# Altium schematic sheet [06] - USB.SchDoc
size A3; CompanyName: FPT-FTI copporation; Address1: FPT Building Duy Tan; Address2: Floor 4,; DocumentNumber: 6; SheetNumber: 6; SheetTotal: 13; NameAuthor: Angle Vu
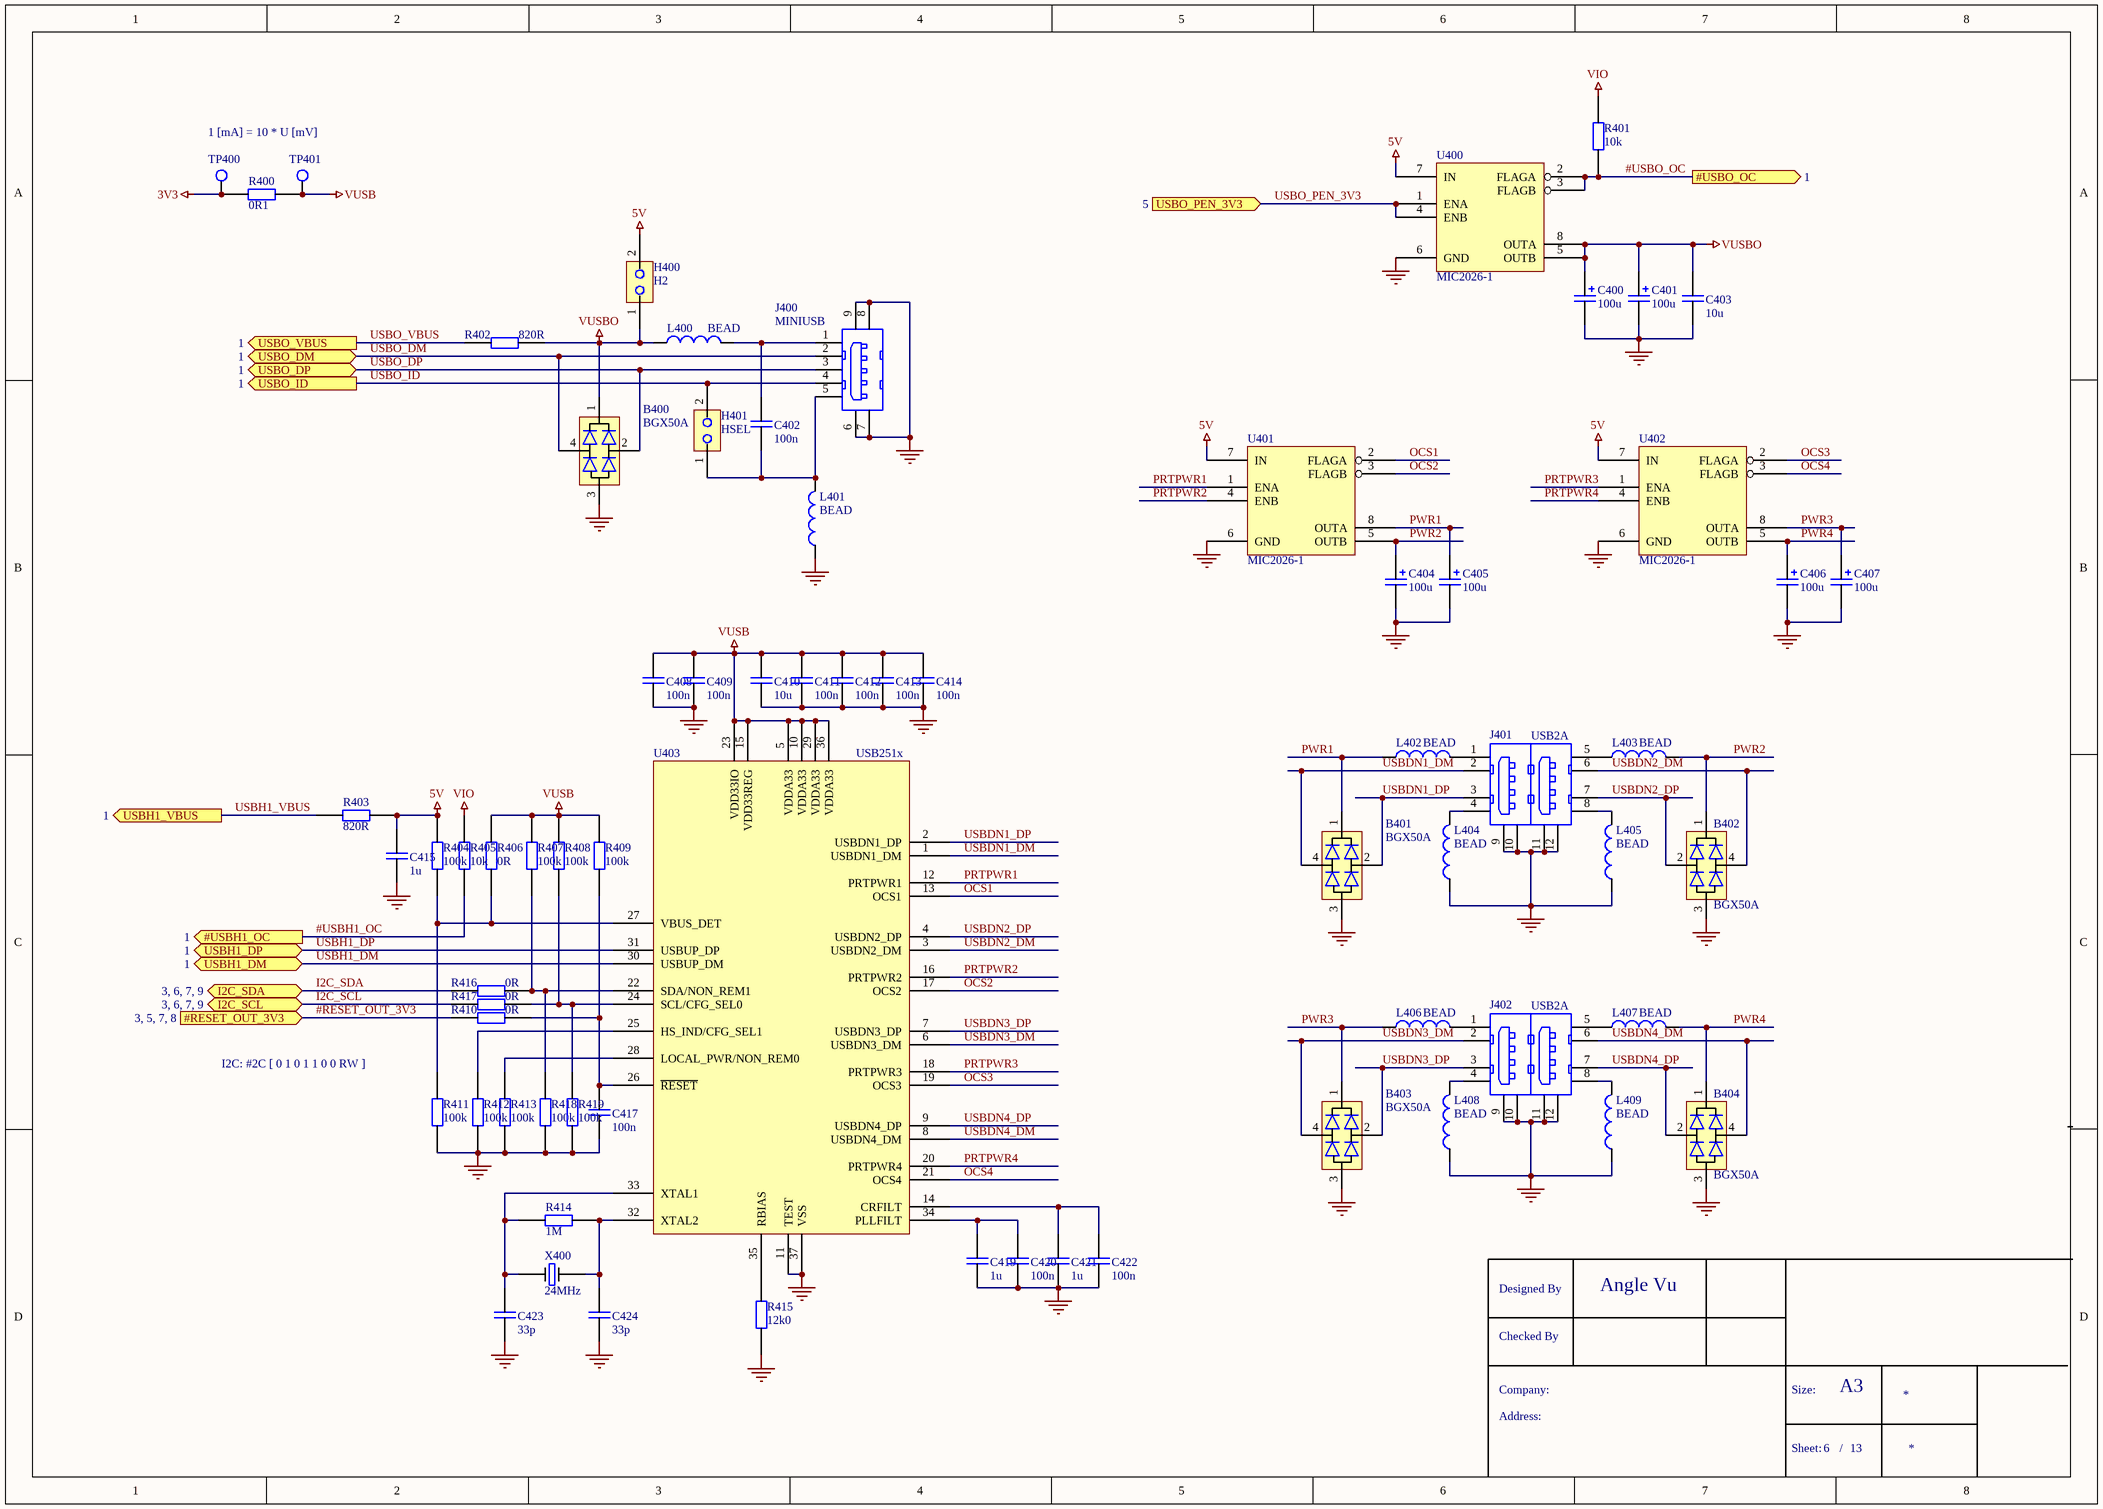
[diagram p0: [06] - USB.SchDoc]

## Parts
B400  BGX50A  [SOT143]
B401  BGX50A  [SOT143]
B402  BGX50A  [SOT143]
B403  BGX50A  [SOT143]
B404  BGX50A  [SOT143]
C400  100u  [CTANTALD]
C401  100u  [CTANTALD]
C402  100n  [0603]
C403  10u  [0805]
C404  100u  [CTANTALD]
C405  100u  [CTANTALD]
C406  100u  [CTANTALD]
C407  100u  [CTANTALD]
C408  100n  [0603]
C409  100n  [0603]
C410  10u  [0805]
C411  100n  [0603]
C412  100n  [0603]
C413  100n  [0603]
C414  100n  [0603]
C415  1u  [0603]
C417  100n  [0603]
C419  1u  [0603]
C420  100n  [0603]
C421  1u  [0603]
C422  100n  [0603]
C423  33p  [0603]
C424  33p  [0603]
H400  H2  [H1x2]
H401  HSEL  [H1x2]
J400  MINIUSB  [MINI_USB_AB]
J401  USB2A  [USB-2A]
J402  USB2A  [USB-2A]
L400  BEAD  [0603]
L401  BEAD  [0603]
L402  BEAD  [0603]
L403  BEAD  [0603]
L404  BEAD  [0603]
L405  BEAD  [0603]
L406  BEAD  [0603]
L407  BEAD  [0603]
L408  BEAD  [0603]
L409  BEAD  [0603]
R400  0R1  [0603]
R401  10k  [0603]
R402  820R  [0603]
R403  820R  [0603]
R404  100k  [0603]
R405  10k  [0603]
R406  0R  [0603]
R407  100k  [0603]
R408  100k  [0603]
R409  100k  [0603]
R410  0R  [0603]
R411  100k  [0603]
R412  100k  [0603]
R413  100k  [0603]
R414  1M  [0603]
R415  12k0  [0603]
R416  0R  [0603]
R417  0R  [0603]
R418  100k  [0603]
R419  100k  [0603]
TP400  TESTPOINT  [TESTPOINT_2mm]  (value not drawn)
TP401  TESTPOINT  [TESTPOINT_2mm]  (value not drawn)
U400  MIC2026-1  [SOIC8N]
U401  MIC2026-1  [SOIC8N]
U402  MIC2026-1  [SOIC8N]
U403  USB251x  [QFN36]
X400  24MHz  [HC494H]

## Ports
#RESET_OUT_3V3 (in, see 3, 5, 7, 8), #USBH1_OC (out, see 1), #USBO_OC (out, see 1), I2C_SCL (bidir, see 3, 6, 7, 9), I2C_SDA (bidir, see 3, 6, 7, 9), USBH1_DM (bidir, see 1), USBH1_DP (bidir, see 1), USBH1_VBUS (out, see 1), USBO_DM (bidir, see 1), USBO_DP (bidir, see 1), USBO_ID (out, see 1), USBO_PEN_3V3 (in, see 5), USBO_VBUS (out, see 1)

## Nets
3V3: R400.1 TP400.1
5V: C415.2 H400.2 R403.1 R404.2 U400.7(IN) U401.7(IN) U402.7(IN)
GND: B400.3 B401.3 B402.3 B403.3 B404.3 C400.2 C401.2 C403.1 C404.2 C405.2 C406.2 C407.2 C408.1 C409.1 C410.1 C411.1 C412.1 C413.1 C414.1 C415.1 C417.1 C419.1 C420.1 C421.1 C422.1 C423.1 C424.1 J400.6(SHIELD) J400.7(SHIELD) J400.8(SHIELD) J400.9(SHIELD) J401.9(SHIELD) J401.10(SHIELD) J401.11(SHIELD) J401.12(SHIELD) J402.9(SHIELD) J402.10(SHIELD) J402.11(SHIELD) J402.12(SHIELD) L401.1 L404.1 L405.1 L408.1 L409.1 R411.2 R412.2 R413.2 R415.1 R418.2 R419.2 U400.6(GND) U401.6(GND) U402.6(GND) U403.11(TEST) U403.37(VSS)
VIO: R401.1 R405.1
VUSB: C408.2 C409.2 C410.2 C411.2 C412.2 C413.2 C414.2 R400.2 R406.2 R407.1 R408.1 R409.1 TP401.1 U403.5(VDDA33) U403.10(VDDA33) U403.15(VDD33REG) U403.23(VDD33IO) U403.29(VDDA33) U403.36(VDDA33)
VUSBO: B400.1 C400.1 C401.1 C403.2 H400.1 L400.1 R402.1 U400.5(OUTB) U400.8(OUTA)
#RESET_OUT_3V3: R410.2 ; port #RESET_OUT_3V3
#USBH1_OC: R405.2 ; port #USBH1_OC
#USBO_OC: R401.2 U400.2(FLAGA) U400.3(FLAGB) ; port #USBO_OC
I2C_SCL: R417.2 ; port I2C_SCL
I2C_SDA: R416.2 ; port I2C_SDA
OCS1: U401.2(FLAGA) U403.13(OCS1)
OCS2: U401.3(FLAGB) U403.17(OCS2)
OCS3: U402.2(FLAGA) U403.19(OCS3)
OCS4: U402.3(FLAGB) U403.21(OCS4)
PRTPWR1: U401.1(ENA) U403.12(PRTPWR1)
PRTPWR2: U401.4(ENB) U403.16(PRTPWR2)
PRTPWR3: U402.1(ENA) U403.18(PRTPWR3)
PRTPWR4: U402.4(ENB) U403.20(PRTPWR4)
PWR1: B401.1 C405.1 L402.1 U401.8(OUTA)
PWR2: B402.1 C404.1 L403.2 U401.5(OUTB)
PWR3: B403.1 C407.1 L406.1 U402.8(OUTA)
PWR4: B404.1 C406.1 L407.2 U402.5(OUTB)
USBDN1_DM: B401.4 J401.2(D-) U403.1(USBDN1_DM)
USBDN1_DP: B401.2 J401.3(D+) U403.2(USBDN1_DP)
USBDN2_DM: B402.4 J401.6(D2-) U403.3(USBDN2_DM)
USBDN2_DP: B402.2 J401.7(D2+) U403.4(USBDN2_DP)
USBDN3_DM: B403.4 J402.2(D-) U403.6(USBDN3_DM)
USBDN3_DP: B403.2 J402.3(D+) U403.7(USBDN3_DP)
USBDN4_DM: B404.4 J402.6(D2-) U403.8(USBDN4_DM)
USBDN4_DP: B404.2 J402.7(D2+) U403.9(USBDN4_DP)
USBH1_DM: U403.30(USBUP_DM) ; port USBH1_DM
USBH1_DP: U403.31(USBUP_DP) ; port USBH1_DP
USBH1_VBUS: R403.2 ; port USBH1_VBUS
USBO_DM: B400.4 J400.2(D-) ; port USBO_DM
USBO_DP: B400.2 J400.3(D+) ; port USBO_DP
USBO_ID: H401.2 J400.4(ID) ; port USBO_ID
USBO_PEN_3V3: U400.1(ENA) U400.4(ENB) ; port USBO_PEN_3V3
USBO_VBUS: R402.2 ; port USBO_VBUS
NetC402_1: C402.1 H401.1 J400.5(GND) L401.2
NetC402_2: C402.2 J400.1(VBUS) L400.2
NetC417_2: C417.2 R409.2 R410.1 U403.26(~{RESET})
NetC419_2: C419.2 C420.2 U403.34(PLLFILT)
NetC421_2: C421.2 C422.2 U403.14(CRFILT)
NetC423_2: C423.2 R414.2 U403.33(XTAL1) X400.1
NetC424_2: C424.2 R414.1 U403.32(XTAL2) X400.2
NetJ401_1: J401.1(VBUS) L402.2
NetJ401_4: J401.4(GND) L404.2
NetJ401_5: J401.5(VBUS2) L403.1
NetJ401_8: J401.8(GND) L405.2
NetJ402_1: J402.1(VBUS) L406.2
NetJ402_4: J402.4(GND) L408.2
NetJ402_5: J402.5(VBUS2) L407.1
NetJ402_8: J402.8(GND) L409.2
NetR404_1: R404.1 R406.1 R411.1 U403.27(VBUS_DET)
NetR407_2: R407.2 R416.1 R418.1 U403.22(SDA/NON_REM1)
NetR408_2: R408.2 R417.1 R419.1 U403.24(SCL/CFG_SEL0)
NetR412_1: R412.1 U403.25(HS_IND/CFG_SEL1)
NetR413_1: R413.1 U403.28(LOCAL_PWR/NON_REM0)
NetR415_2: R415.2 U403.35(RBIAS)

## Notes on the sheet
- 1 [mA] = 10 * U [mV]
- (near R411) I2C: #2C [ 0 1 0 1 1 0 0 RW ]
- Designed By
- Checked By
- Company:
- Size:
- A3
- Address:
- Sheet:
- /

## Library data of the parts
C400 C401 C404-C407 = C+
C402 C403 C408-C415 C417 C419-C424 = C
H401 = H2
L400-L409 = FBEAD
R400-R419 = R
TP400 TP401 = TESTPOINT: Testpoint pad; Order number: no component; Component class: TP; Producer: n/a; Assembly type: no component
U400-U402 = MIC2026
X400 = XTAL